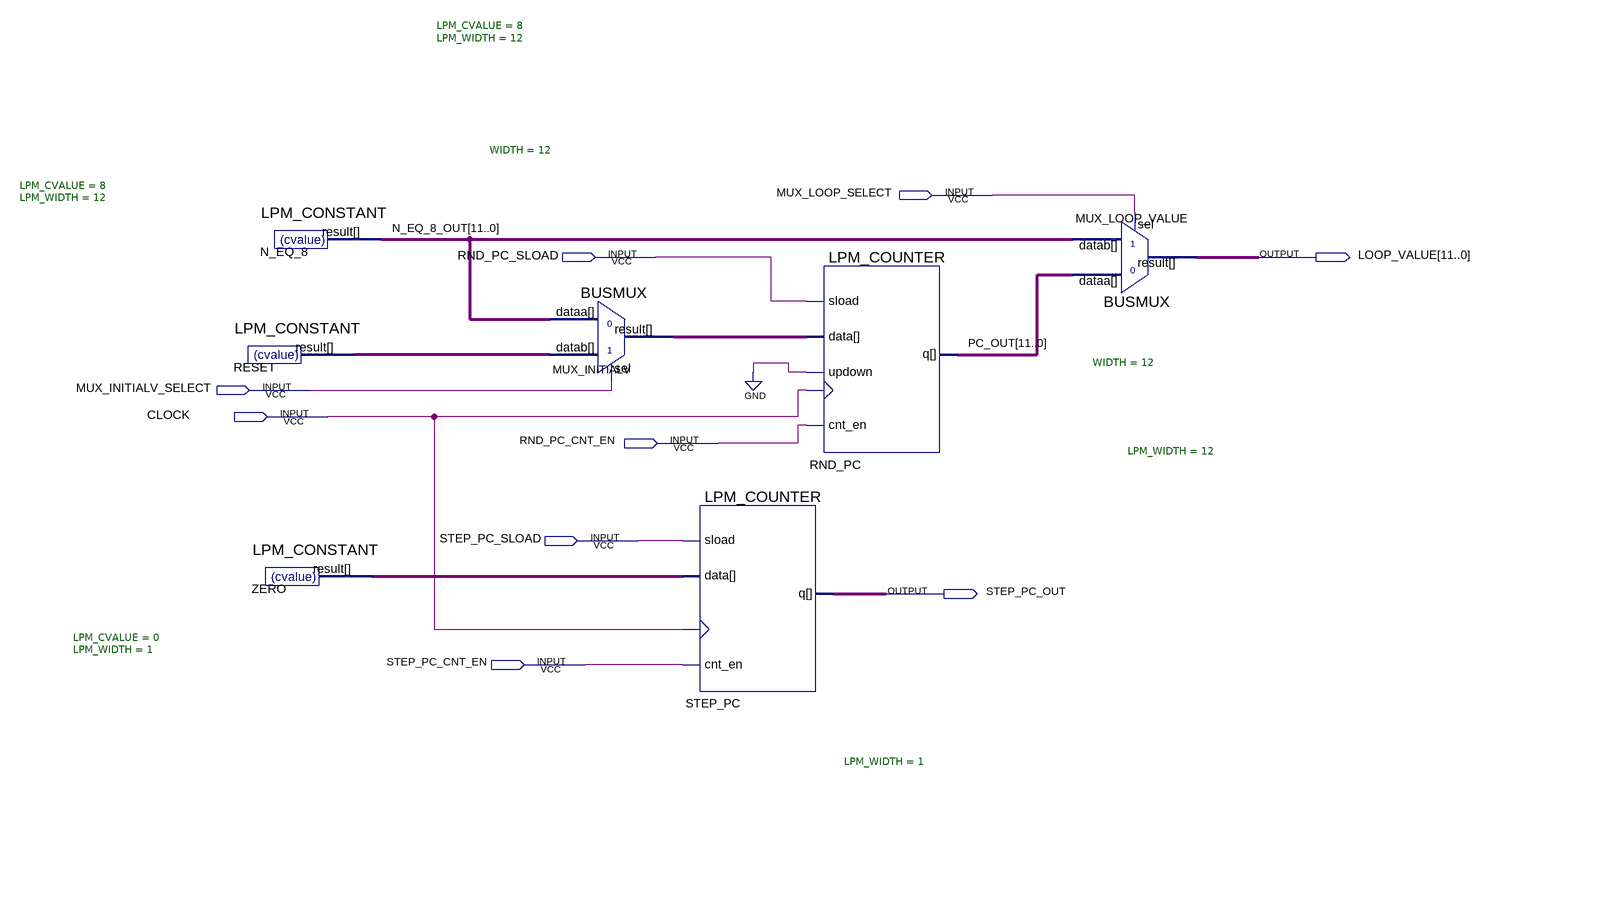
[diagram p0: schematic sheet]
// Quartus schematic RND_DOUBLE_PC.bdf as structural Verilog: 7 symbols, 9 pins
module RND_DOUBLE_PC (
  input  MUX_LOOP_SELECT,
  input  RND_PC_SLOAD,
  input  MUX_INITIALV_SELECT,
  input  CLOCK,
  input  RND_PC_CNT_EN,
  input  STEP_PC_SLOAD,
  input  STEP_PC_CNT_EN,
  output [11:0] LOOP_VALUE,
  output STEP_PC_OUT
);

  wire ZERO_result;
  wire [11:0] MUX_INITIALV_result, N_EQ_8_OUT, PC_OUT, RESET_result;

  LPM_CONSTANT #(.LPM_CVALUE(8), .LPM_WIDTH(12)) N_EQ_8 (.result(N_EQ_8_OUT));
  LPM_CONSTANT #(.LPM_CVALUE(8), .LPM_WIDTH(12)) RESET (.result(RESET_result));
  LPM_CONSTANT #(.LPM_CVALUE(0), .LPM_WIDTH(1)) ZERO (.result(ZERO_result));
  BUSMUX #(.WIDTH(12)) MUX_INITIALV (
    .datab(RESET_result), .sel(MUX_INITIALV_SELECT), .dataa(N_EQ_8_OUT), .result(MUX_INITIALV_result));
  LPM_COUNTER #(.LPM_WIDTH(1)) STEP_PC (
    .clock(CLOCK), .cnt_en(STEP_PC_CNT_EN), .data(ZERO_result), .sload(STEP_PC_SLOAD), .q(STEP_PC_OUT));
  LPM_COUNTER #(.LPM_WIDTH(12)) RND_PC (
    .clock(CLOCK), .cnt_en(RND_PC_CNT_EN), .data(MUX_INITIALV_result), .sload(RND_PC_SLOAD), .updown(1'b0),
    .q(PC_OUT));
  BUSMUX #(.WIDTH(12)) MUX_LOOP_VALUE (.datab(N_EQ_8_OUT), .sel(MUX_LOOP_SELECT), .dataa(PC_OUT), .result(LOOP_VALUE));
endmodule
